# EAGLE design main_board (EAGLE 7.5.0)
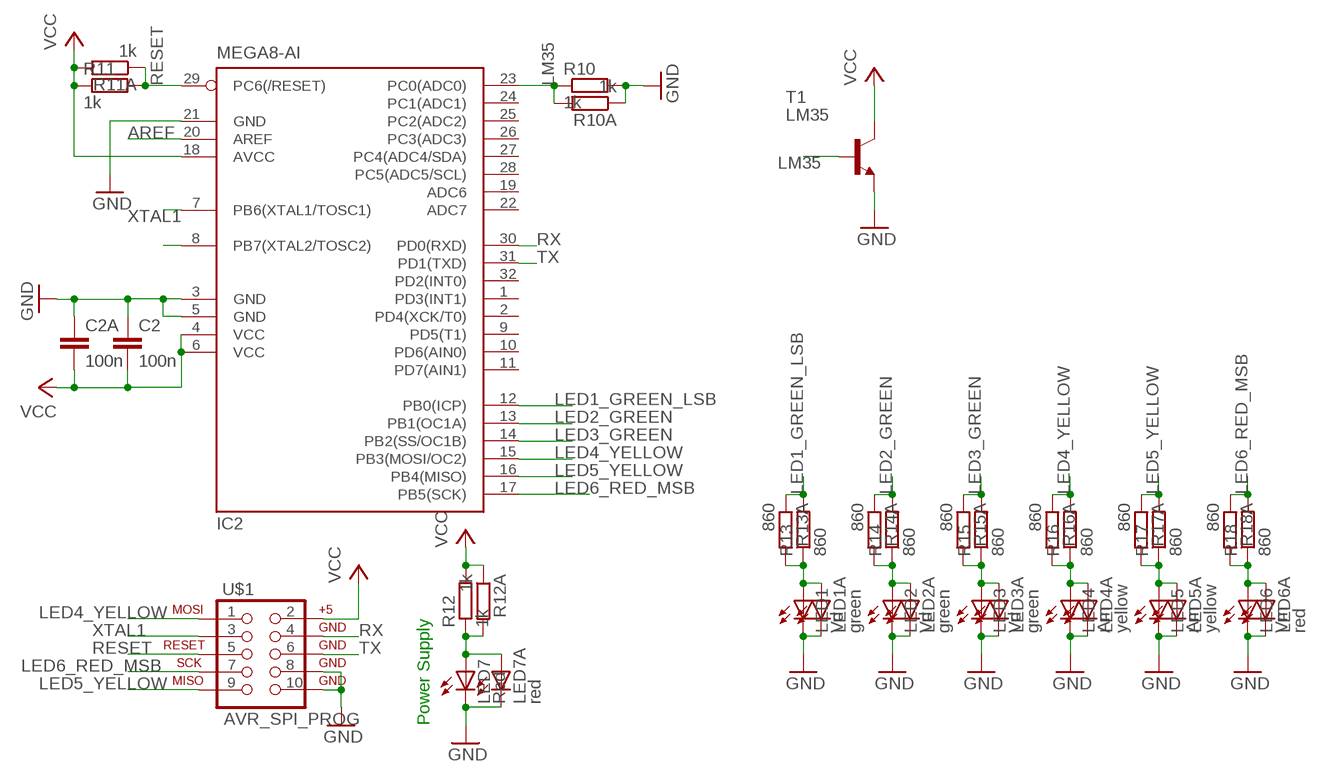
[diagram p0: schematic, sheet 1]

## Parts
C2  100n  C5/3  [C5B3]
C2A  100n  C-EUC0805  [C0805]
IC2  MEGA8-AI  [TQFP32-08]
LED1  Vd  LED3MM  [LED3MM]
LED1A  green  LEDCHIP-LED0805  [CHIP-LED0805]
LED2  Vd  LED3MM  [LED3MM]
LED2A  green  LEDCHIP-LED0805  [CHIP-LED0805]
LED3  Vd  LED3MM  [LED3MM]
LED3A  green  LEDCHIP-LED0805  [CHIP-LED0805]
LED4  Am  LED3MM  [LED3MM]
LED4A  yellow  LEDCHIP-LED0805  [CHIP-LED0805]
LED5  Am  LED3MM  [LED3MM]
LED5A  yellow  LEDCHIP-LED0805  [CHIP-LED0805]
LED6  Vm  LED3MM  [LED3MM]
LED6A  red  LEDCHIP-LED0805  [CHIP-LED0805]
LED7  Red  LED3MM  [LED3MM]
LED7A  red  LEDCHIP-LED0805  [CHIP-LED0805]
R10  1k  R-EU_0207/10  [0207/10]
R10A  1k  R-EU_M0805  [M0805]
R11  1k  R-EU_0207/10  [0207/10]
R11A  1k  R-EU_M0805  [M0805]
R12  1k  R-EU_0207/10  [0207/10]
R12A  1k  R-EU_M0805  [M0805]
R13  860  R-EU_0207/10  [0207/10]
R13A  860  R-EU_M0805  [M0805]
R14  860  R-EU_0207/10  [0207/10]
R14A  860  R-EU_M0805  [M0805]
R15  860  R-EU_0207/10  [0207/10]
R15A  860  R-EU_M0805  [M0805]
R16  860  R-EU_0207/10  [0207/10]
R16A  860  R-EU_M0805  [M0805]
R17  860  R-EU_0207/10  [0207/10]
R17A  860  R-EU_M0805  [M0805]
R18  860  R-EU_0207/10  [0207/10]
R18A  860  R-EU_M0805  [M0805]
T1  LM35  MPS2222A-NPN-TO92-CBE  [TO92-CBE]
U$1  AVR_SPI_PROG  [AVR_ICSP]

## Nets
AREF: IC2.20(AREF)
GND: C2.1 C2A.1 IC2.3(GND) IC2.5(GND) IC2.21(GND) LED1.K(C) LED1A.C LED2.K(C) LED2A.C LED3.K(C) LED3A.C LED4.K(C) LED4A.C LED5.K(C) LED5A.C LED6.K(C) LED6A.C LED7.K(C) LED7A.C R10.2 R10A.1 T1.E U$1.8 U$1.10
LED1_GREEN_LSB: IC2.12(PB0(ICP)) R13.2 R13A.1
LED2_GREEN: IC2.13(PB1(OC1A)) R14.2 R14A.1
LED3_GREEN: IC2.14(PB2(SS/OC1B)) R15.2 R15A.1
LED4_YELLOW: IC2.15(PB3(MOSI/OC2)) R16.2 R16A.1 U$1.1
LED5_YELLOW: IC2.16(PB4(MISO)) R17.2 R17A.1 U$1.9
LED6_RED_MSB: IC2.17(PB5(SCK)) R18.2 R18A.1 U$1.7
LM35: IC2.23(PC0(ADC0)) R10.1 R10A.2 T1.B
N$1: LED1.A LED1A.A R13.1 R13A.2
N$3: IC2.8(PB7(XTAL2/TOSC2))
N$4: LED2.A LED2A.A R14.1 R14A.2
N$6: LED7.A LED7A.A R12.1 R12A.2
N$7: LED3.A LED3A.A R15.1 R15A.2
N$8: LED4.A LED4A.A R16.1 R16A.2
N$9: LED5.A LED5A.A R17.1 R17A.2
N$10: LED6.A LED6A.A R18.1 R18A.2
RESET: IC2.29(PC6(/RESET)) R11.2 R11A.1 U$1.5
RX: IC2.30(PD0(RXD)) U$1.4
TX: IC2.31(PD1(TXD)) U$1.6
VCC: C2.2 C2A.2 IC2.4(VCC) IC2.6(VCC) IC2.18(AVCC) R11.1 R11A.2 R12.2 R12A.1 T1.C U$1.2
XTAL1: IC2.7(PB6(XTAL1/TOSC1)) U$1.3
Unconnected: IC2.1(PD3(INT1)) IC2.2(PD4(XCK/T0)) IC2.9(PD5(T1)) IC2.10(PD6(AIN0)) IC2.11(PD7(AIN1)) IC2.19(ADC6) IC2.22(ADC7) IC2.24(PC1(ADC1)) IC2.25(PC2(ADC2)) IC2.26(PC3(ADC3)) IC2.27(PC4(ADC4/SDA)) IC2.28(PC5(ADC5/SCL)) IC2.32(PD2(INT0))

## Notes on the sheet
- Power Supply

## Library data of the parts
C2 = capacitor-wima:C: CAPACITOR naming: grid - package width
C2A = rcl:C-EU: CAPACITOR, European symbol
IC2 = atmel:MEGA8: MICROCONTROLLER 8 Kbytes FLASH, 1 kbytes SRAM, 512 bytes EEPROM, USART, 6-channel 10 bit ADC, 2-channel 8 bit ADC Pin compatible with Atmega48, ATMega88, ATMega168 Source: avr.lbr; MPN: ATMEGA8-16AU; OC_FARNELL: 9171371; OC_NEWARK: 73M8863
LED1 LED1A LED2 LED2A LED3 LED3A LED4 LED4A LED5 LED5A LED6 LED6A LED7 LED7A = led:LED: LED OSRAM: - CHIPLED LG R971, LG N971, LY N971, LG Q971, LY Q971, LO R971, LY R971 LH N974, LH R974 LS Q976, LO Q976, LY Q976 LO Q996 - Hyper CHIPLED LW Q18S LB Q993, LB Q99A, LB R99A - SideLED LS A670, LO A670, LY A670, LG A670, LP A670 LB A673, LV A673, LT A673, LW A673 LH A674 LY A675 LS A676, LA A676, LO A676, LY A676, LW A676 LS A679, LY A679, LG A679 - Hyper Micro SIDELED® LS Y876, LA Y876, LO Y876, LY Y876 LT Y87S - SmartLED LW L88C, LW L88S LB L89C, LB L89S, LG L890 LS L89K, LO L89K, LY L89K LS L896, LA L896, LO L896, LY L896 - TOPLED LS T670, LO T670, LY T670, LG T670, LP T670 LSG T670, LSP T670, LSY T670, LOP T670, LYG T670 LG T671, LOG T671, LSG T671 LB T673, LV T673, LT T673, LW T673 LH T674 LS T676, LA T676, LO T676, LY T676, LB T676, LH T676, LSB T676, LW T676 LB T67C, LV T67C, LT T67C, LS T67K, LO T67K, LY T67K, LW E67C LS E67B, LA E67B, LO E67B, LY E67B, LB E67C, LV E67C, LT E67C LW T67C LS T679, LY T679, LG T679 LS T770, LO T770, LY T770, LG T770, LP T770 LB T773, LV T773, LT T773, LW T773 LH T774 LS E675, LA E675, LY E675, LS T675 LS T776, LA T776, LO T776, LY T776, LB T776 LHGB T686 LT T68C, LB T68C - Hyper Mini TOPLED® LB M676 - Mini TOPLED Santana® LG M470 LS M47K, LO M47K, LY M47K Source: http://www.osram.convergy.de LUXEON: - LUMILED® LXK2-PW12-R00, LXK2-PW12-S00, LXK2-PW14-U00, LXK2-PW14-V00 LXK2-PM12-R00, LXK2-PM12-S00, LXK2-PM14-U00 LXK2-PE12-Q00, LXK2-PE12-R00, LXK2-PE12-S00, LXK2-PE14-T00, LXK2-PE14-U00 LXK2-PB12-K00, LXK2-PB12-L00, LXK2-PB12-M00, LXK2-PB14-N00, LXK2-PB14-P00, LXK2-PB14-Q00 LXK2-PR12-L00, LXK2-PR12-M00, LXK2-PR14-Q00, LXK2-PR14-R00 LXK2-PD12-Q00, LXK2-PD12-R00, LXK2-PD12-S00 LXK2-PH12-R00, LXK2-PH12-S00 LXK2-PL12-P00, LXK2-PL12-Q00, LXK2-PL12-R00 Source: www.luxeon.com KINGBRIGHT: KA-3528ASYC Source: www.kingbright.com
R10-R18 = resistor:R-EU_: RESISTOR, European symbol
R10A R11A R12A R13A R14A R15A R16A R17A R18A = rcl:R-EU_: RESISTOR, European symbol
T1 = transistor:*-NPN-: NPN Transistror BF959 corrected 2008.03.06
U$1 = SparkFun-Connectors:AVR_SPI_PROG: AVR 10-pin ICSP Header This is the standard AVR In Circuit Serial Programming header. Minimal, but includes pin one indicator. Works with standard Olimex programmers. Also look for the 6-pin reduced version. Spark Fun Electronics SKU: PRT-00778

## Board
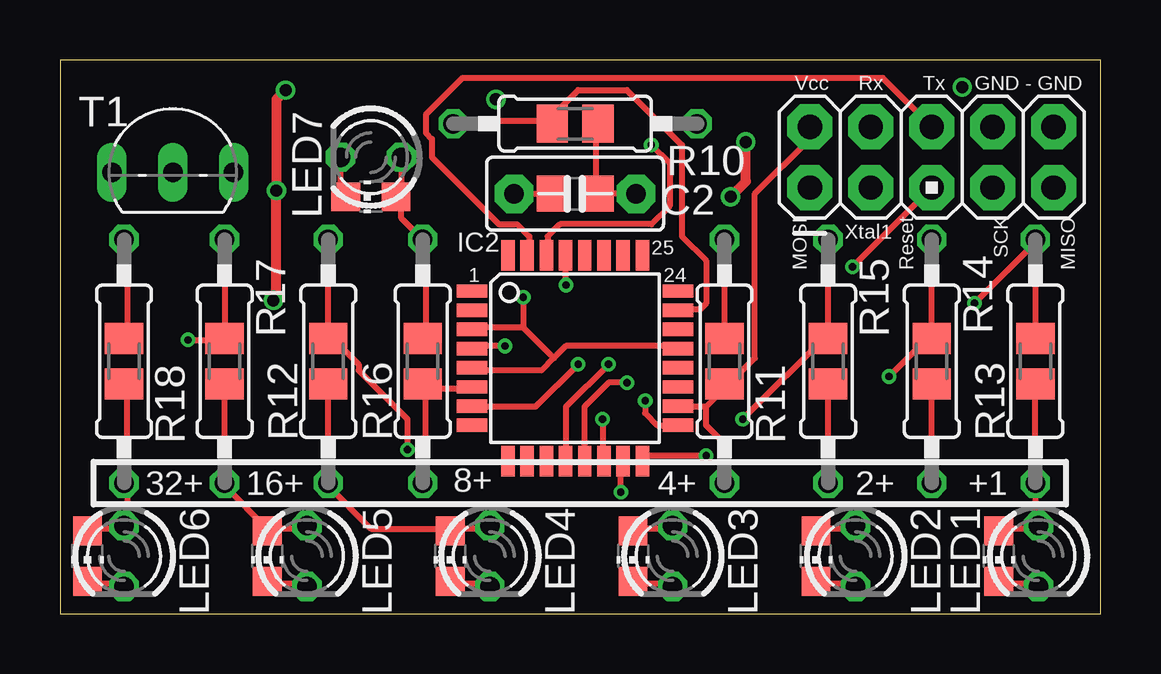
[diagram p1: board, top side]
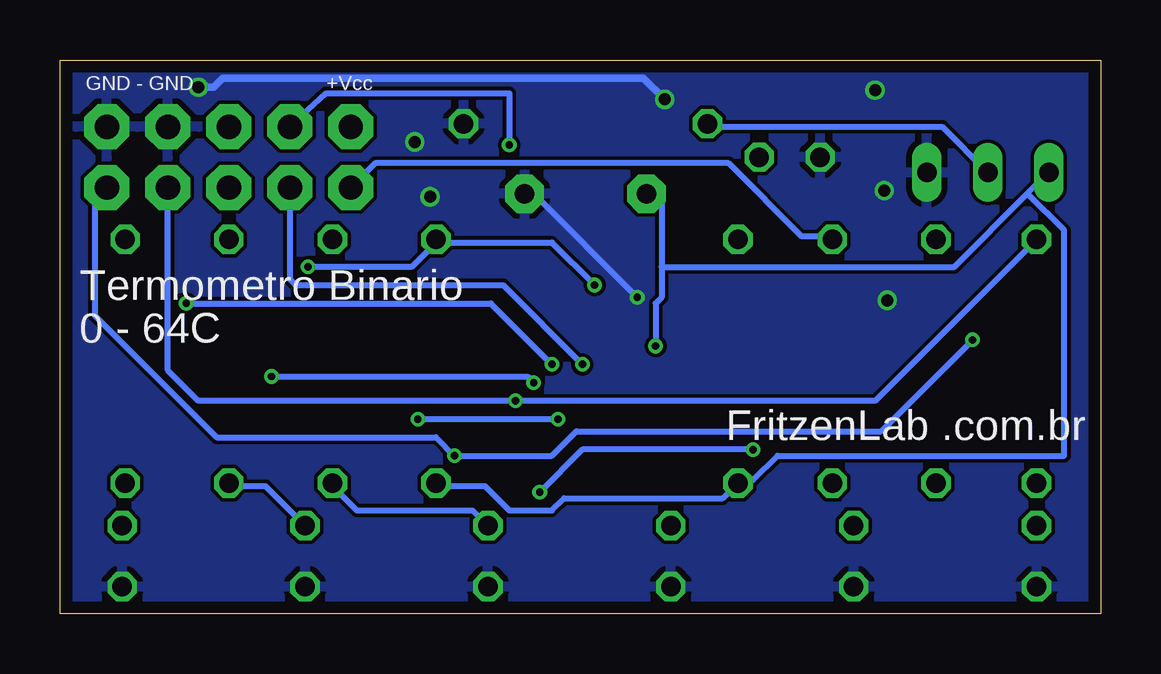
[diagram p2: board, bottom side, seen from below]

Size 43.36 x 23.1 mm. Coordinates in mm from the lower left corner, seen from the top.
Outline: 0,0 43.36,0 43.36,23.1 0,23.1 0,0
Copper layers (1*16): Top 0.035mm / dielectric 1.6mm / Bottom 0.035mm
Design rules "Elecrow_2-layer_PCB_eagle_rule": minimum track width 6mil, minimum drill 12mil, track to track 6mil, track to pad 6mil, pad to pad 6mil, via to via 8mil, smd to smd 0mil, copper to edge 20mil, drill to drill 10mil, minimum pad ring 6mil, minimum via ring 6mil, stop-mask expansion 0mil, vias tented up to drill 100mil, thermal gap 10mil

### Footprints (pad centres in the part's own frame; a part is rotated, then mirrored left to right if it is on the bottom)
C5B3 = drill 0.813 pad 1.6 octagon: 1 -2.54,0; 2 2.54,0
C0805 = smd 1.3 x 1.5: 1 -0.95,0; 2 0.95,0
TQFP32-08 = smd 1.27 x 0.559: 1 -4.293,2.8; 2 -4.293,2; 3 -4.293,1.2; 4 -4.293,0.4; 5 -4.293,-0.4; 6 -4.293,-1.2; 7 -4.293,-2; 8 -4.293,-2.8; 17 4.293,-2.8; 18 4.293,-2; 19 4.293,-1.2; 20 4.293,-0.4; 21 4.293,0.4; 22 4.293,1.2; 23 4.293,2; 24 4.293,2.8 | smd 0.559 x 1.27: 9 -2.8,-4.293; 10 -2,-4.293; 11 -1.2,-4.293; 12 -0.4,-4.293; 13 0.4,-4.293; 14 1.2,-4.293; 15 2,-4.293; 16 2.8,-4.293; 25 2.8,4.293; 26 2,4.293; 27 1.2,4.293; 28 0.4,4.293; 29 -0.4,4.293; 30 -1.2,4.293; 31 -2,4.293; 32 -2.8,4.293
LED3MM = drill 0.813 octagon: A -1.27,0; K 1.27,0
CHIP-LED0805 = smd 1.2 x 1.2: A 0,-1.05; C 0,1.05
0207/10 = drill 0.813 octagon: 1 -5.08,0; 2 5.08,0
M0805 = smd 1.3 x 1.6: 1 -0.95,0; 2 0.95,0
TO92-CBE = drill 0.813 long: B 0,0; C -2.54,0; E 2.54,0
AVR_ICSP = drill 1.016 pad 1.88 octagon: 1 -1.27,5.08; 2 1.27,5.08; 3 -1.27,2.54; 4 1.27,2.54; 5 -1.27,0; 6 1.27,0; 7 -1.27,-2.54; 8 1.27,-2.54; 9 -1.27,-5.08; 10 1.27,-5.08

### Placement (x,y rotation side)
C2  21.46,17.53 180 top
C2A  21.46,17.53 180 top
IC2  21.46,10.67 0 top
LED1  40.77,2.41 270 top
LED1A  39.12,2.41 180 top
LED2  33.15,2.41 270 top
LED2A  31.5,2.41 180 top
LED3  25.53,2.41 270 top
LED3A  23.88,2.41 180 top
LED4  17.91,2.41 270 top
LED4A  16.26,2.41 180 top
LED5  10.29,2.41 270 top
LED5A  8.64,2.41 180 top
LED6  2.67,2.41 270 top
LED6A  1.14,2.41 180 top
LED7  12.95,19.05 180 top
LED7A  12.95,17.4 90 top
R10  21.46,20.45 0 top
R10A  21.46,20.45 180 top
R11  27.69,10.54 90 top
R11A  27.69,10.54 270 top
R12  15.11,10.54 270 top
R12A  15.11,10.54 90 top
R13  40.64,10.54 90 top
R13A  40.64,10.54 270 top
R14  36.32,10.54 90 top
R14A  36.32,10.54 270 top
R15  32,10.54 90 top
R15A  32,10.54 270 top
R16  11.18,10.54 90 top
R16A  11.18,10.54 270 top
R17  6.86,10.54 90 top
R17A  6.86,10.54 270 top
R18  2.67,10.54 90 top
R18A  2.67,10.54 270 top
T1  4.7,18.41 0 top
U$1  36.32,19.05 90 top

### Tracks (layer width: path | path; a pad name or v marks a point on that pad's centre or on a via)
GND  (via drill 0.3, 0.5)
  Top 0.254: 20.57,10.67 21.08,11.18 25.65,11.18 IC2.21 | 20.57,10.67 20.07,10.16 17.27,10.16 IC2.5 | 19.3,11.94 17.27,11.94 IC2.3 | 20.57,10.67 19.3,11.94 | LED6A.C 1.27,1.27 2.54,1.27 LED6.K | LED5A.C 8.64,1.27 10.16,1.27 LED5.K | LED4A.C 16.26,1.27 17.78,1.27 LED4.K | LED3A.C 23.88,1.27 25.4,1.27 LED3.K | LED7.K 11.68,17.53 LED7A.C | LED2A.C 31.5,1.27 33.02,1.27 LED2.K | LED1A.C 39.12,1.27 40.64,1.27 LED1.K | C2.1 C2A.1 22.35,17.53 22.35,20.32 R10A.1 | v19.3,13.21 19.3,11.94
  Top 0.406: v8.89,13.08 9.02,13.08 v9.02,17.65 9.02,21.46 v9.4,21.84 | v27.94,17.4 28.57,18.03 v28.57,19.68
  Bottom 0.254: v19.3,13.21 23.62,17.53 C2.1
  Bottom 0.305: v18.16,21.46 19.05,22.35 36.58,22.35 36.96,21.97 v37.59,21.97
  pour Bottom: 0,0 0,23.11 43.43,23.11 43.43,-0.13
LED1_GREEN_LSB  (via drill 0.3)
  Top 0.254: v22.86,10.41 21.08,8.64 21.08,6.6 IC2.12 | 40.64,15.49 v38.1,12.95 | 40.64,15.49 R13A.1 | 40.64,15.49 R13.2
  Bottom 0.254: v22.86,10.41 25.4,12.95 v38.1,12.95
LED2_GREEN  (via drill 0.3)
  Top 0.254: v23.62,9.65 22.86,9.65 21.84,8.64 21.84,6.6 IC2.13 | 36.32,11.68 v34.54,9.91 | 36.32,11.68 R14.2 | 36.32,11.68 R14A.1
  Bottom 0.254: v23.62,9.65 23.88,9.91 v34.54,9.91
LED3_GREEN  (via drill 0.3)
  Top 0.254: v22.61,8.13 22.61,6.6 IC2.14 | 32,11.68 v28.45,8.13 | 32,11.68 R15.2 | 32,11.68 R15A.1
  Bottom 0.254: v28.45,8.13 v22.61,8.13
LED4_YELLOW  (via drill 0.3)
  Top 0.254: v23.37,5.08 23.37,6.35 IC2.15 | v14.48,6.86 14.48,8.13 12.45,10.16 12.45,10.41 11.18,11.68 | 11.18,11.68 R16.2 | 11.18,11.68 R16A.1
  Bottom 0.254: v23.37,5.08 21.59,6.86 v14.48,6.86 | U$1.1 30.23,18.8 15.49,18.8 12.45,15.75 11.18,15.75 R16.2
LED5_YELLOW  (via drill 0.3)
  Top 0.254: R17.2 R17A.1 6.86,11.43 v5.33,11.43 | v26.92,6.6 24.38,6.6 IC2.16
  Bottom 0.254: U$1.9 41.91,17.78 41.91,12.45 36.83,7.37 27.69,7.37 v26.92,6.6 22.86,6.6 21.84,7.62 9.14,7.62 v5.33,11.43
LED6_RED_MSB  (via drill 0.3)
  Top 0.254: v24.38,8.89 24.38,8.38 24.89,7.87 25.65,7.87 IC2.17 | R18A.1 2.79,11.68 2.79,15.49 R18.2
  Bottom 0.254: R18.2 9.4,8.89 v24.38,8.89 37.59,8.89 38.86,10.16 U$1.7
LM35
  Top 0.254: 20.32,20.57 21.59,21.84 23.62,21.84 25.91,19.56 25.91,15.75 26.92,14.73 26.92,12.95 26.67,12.7 25.91,12.7 IC2.23 | 20.32,20.57 16.51,20.57 R10.1 | 20.32,20.57 R10A.2
  Bottom 0.254: T1.B 6.6,20.32 16.26,20.32 R10.1
N$1
  Top 0.254: LED1A.A 39.12,3.56 40.64,3.56 LED1.A 40.64,3.81 R13.1 R13A.2
N$4
  Top 0.254: LED2A.A 31.5,3.56 33.02,3.56 LED2.A | R14.1 R14A.2
  Bottom 0.254: LED2.A 34.8,5.33 36.32,5.33 R14.1
N$6
  Top 0.254: LED7.A 14.22,17.53 LED7A.A 14.22,17.27 14.22,16.51 R12.1 15.24,15.49 15.24,11.68 R12A.2
N$7
  Top 0.254: LED3A.A 23.88,3.56 25.4,3.56 LED3.A | R15.1 R15A.2
  Bottom 0.254: LED3.A 26.16,4.32 30.99,4.32 32,5.33 R15.1
N$8
  Top 0.254: 16.26,3.56 17.78,3.56 LED4.A | R16A.2 R16.1 11.18,5.33 12.95,3.56 16.26,3.56 | 16.26,3.56 LED4A.A
N$9
  Top 0.254: 8.64,3.56 10.16,3.56 LED5.A | R17A.2 R17.1 6.86,5.33 8.64,3.56 | 8.64,3.56 LED5A.A
N$10
  Top 0.254: LED6A.A 1.27,3.56 2.54,3.56 LED6.A 2.79,3.81 2.79,5.33 R18.1 2.79,5.59 2.79,9.4 R18A.2
RESET  (via drill 0.3)
  Top 0.254: v21.08,13.72 21.08,14.73 IC2.29 | R11.2 R11A.1 | v33.02,14.48 U$1.5
  Bottom 0.254: v21.08,13.72 22.86,15.49 27.69,15.49 | v33.02,14.48 28.7,14.48 27.69,15.49 | 27.69,15.49 R11.2
RX  (via drill 0.3)
  Top 0.254: v24.64,19.56 25.4,18.8 25.4,17.02 24.64,16.26 20.83,16.26 20.32,15.75 20.32,14.99 IC2.30
  Bottom 0.254: v24.64,19.56 24.64,21.72 32.26,21.72 U$1.4
TX
  Top 0.254: U$1.6 34.29,22.35 16.76,22.35 15.24,20.83 15.24,20.07 15.49,19.81 15.49,19.05 18.29,16.26 19.05,16.26 19.56,15.75 19.56,14.99 IC2.31
VCC  (via drill 0.3)
  Top 0.254: v18.54,11.18 17.27,11.18 IC2.4 | C2.2 C2A.2 | 15.24,9.4 17.02,9.4 IC2.6 | 15.24,9.4 15.24,5.59 R12.2 | 15.24,9.4 R12A.1 | 26.92,8.64 25.91,8.64 IC2.18 | 27.69,9.4 26.92,8.64 | 26.92,8.64 26.92,7.87 27.69,7.11 R11.1 | U$1.2 31.24,19.81 28.96,17.53 28.96,10.67 27.69,9.4 | 27.69,9.4 R11A.2
  Bottom 0.254: v18.54,11.18 18.54,12.95 18.29,13.21 18.29,14.48 | 18.29,14.48 18.29,17.53 C2.2 | 3.05,17.53 6.1,14.48 18.29,14.48 | 3.05,17.53 T1.C | R11.1 27.69,5.33 25.65,5.33 24.64,4.32 22.86,4.32 22.35,4.83 15.75,4.83 R12.2 14.99,5.59 14.48,5.59 13.46,6.6 1.52,6.6 1.52,16 3.05,17.53
XTAL1  (via drill 0.3)
  Top 0.254: v21.59,10.41 19.81,8.64 17.27,8.64 IC2.7
  Bottom 0.254: v21.59,10.41 24.89,13.72 33.53,13.72 33.78,13.97 U$1.3

### Text on the board
tNames: Vcc | Rx | Tx | GND - GND | Xtal1 | 25 | SCK | 1 | 24 | MOSI | Reset | MISO | 32+ | 16+ | 8+ | 4+ | 2+ | +1
bNames: +Vcc | GND - GND | Termometro Binario | 0 - 64C | FritzenLab .com.br